# EAGLE design metaboard_mine (EAGLE 6.5.0)
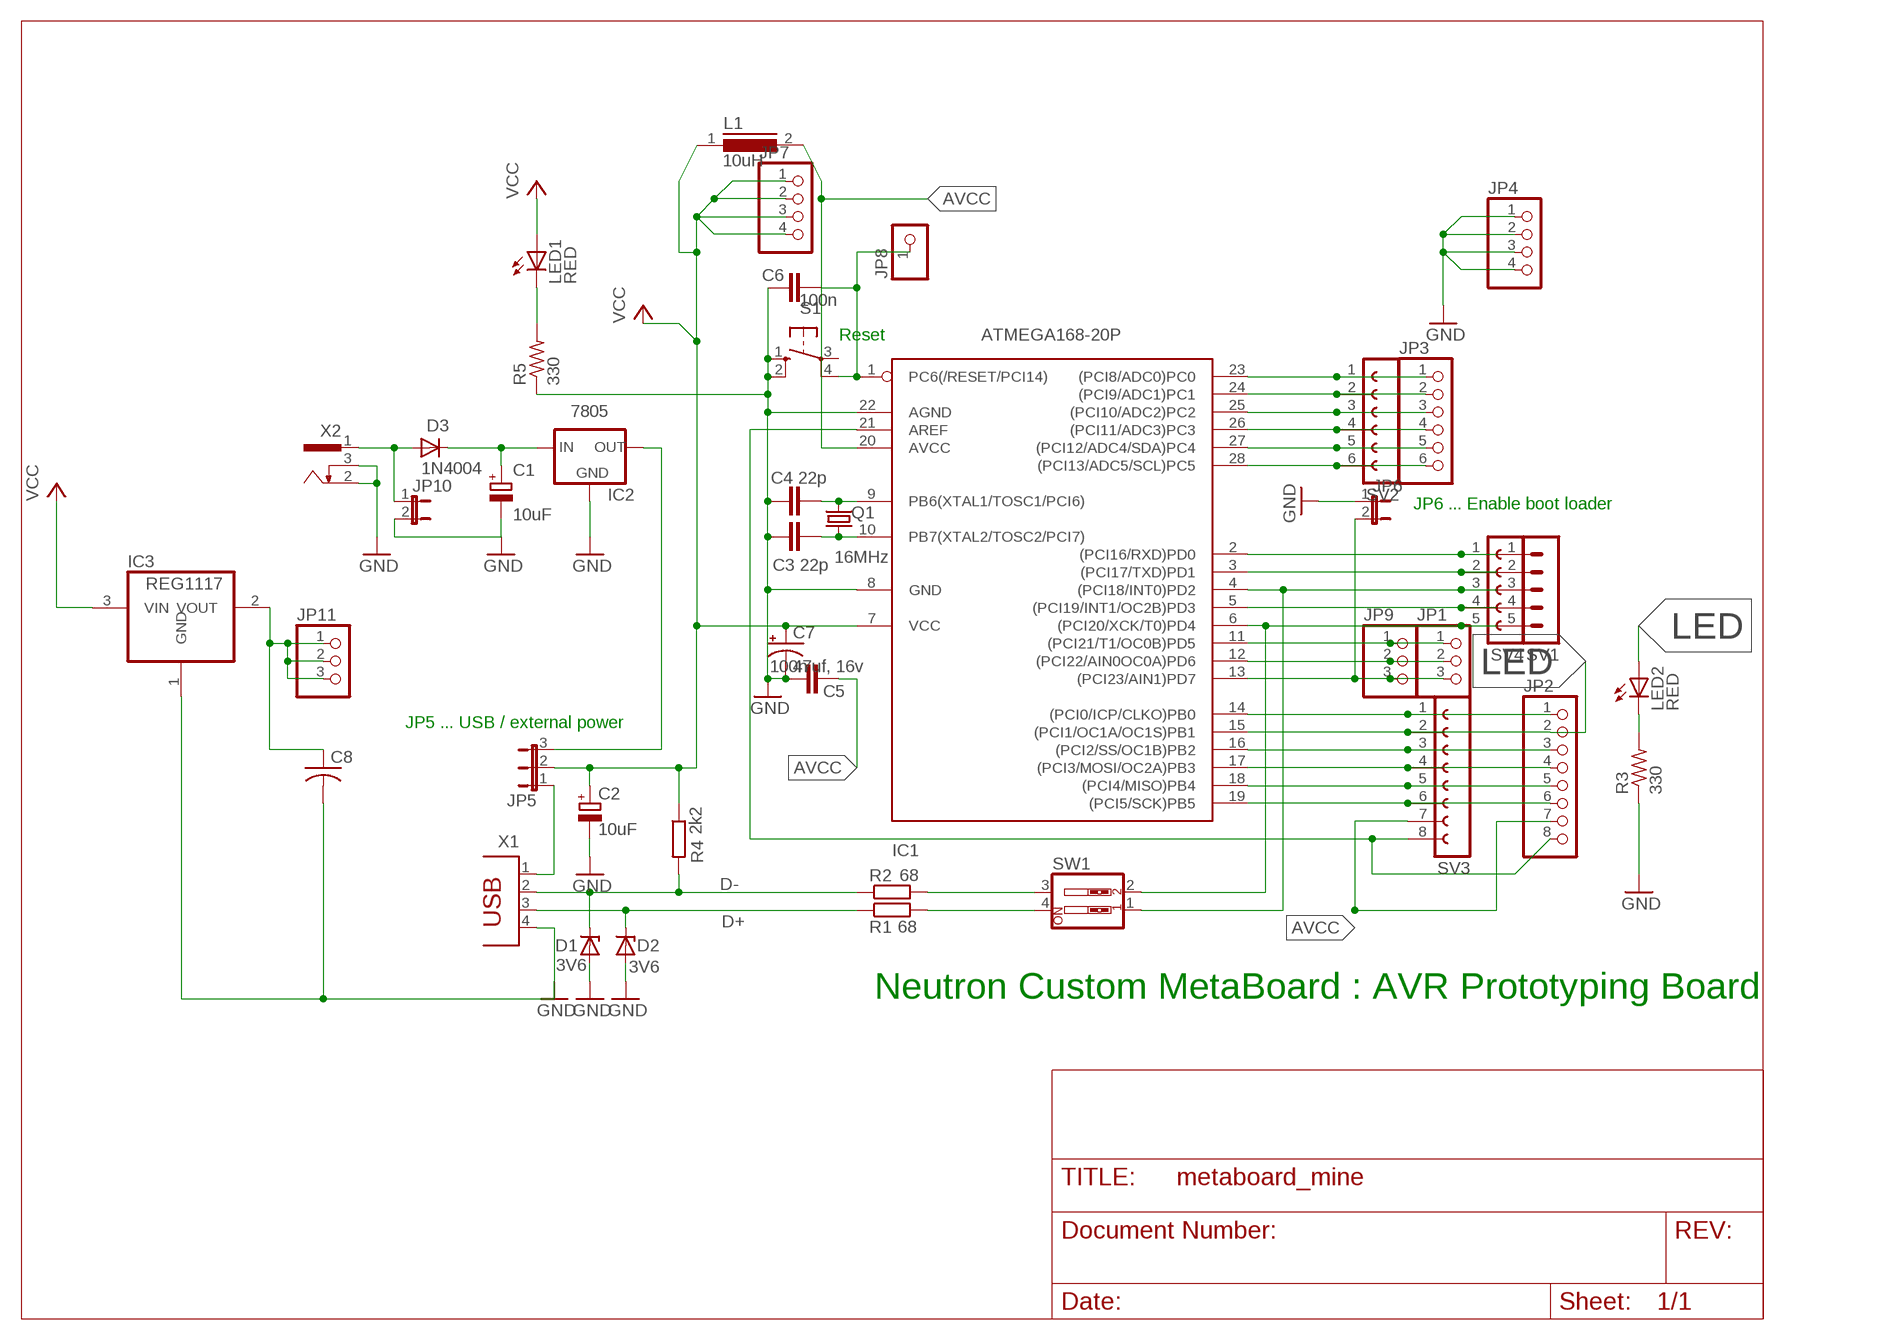
[diagram p0: schematic, sheet 1]

## Parts
C1  10uF  CPOL-EUE3.5-10  [E3,5-10]
C2  10uF  CPOL-EUE2,5-6E  [E2,5-6E]
C3  22p  C-EU025-024X044  [C025-024X044]
C4  22p  C-EU025-024X044  [C025-024X044]
C5  100n  C-EU050-025X075  [C050-025X075]
C6  100n  C-EU050-025X075  [C050-025X075]
C7  47uf, 16v  CPOL-USE2.5-6  [E2,5-6]
C8  C-USC0805K  [C0805K]
D1  3V6  ZENER-DIODEDO34-7  [DO34Z7]
D2  3V6  ZENER-DIODEDO34-7  [DO34Z7]
D3  1N4004  [DO41-10]
IC1  ATMEGA168-20P  [DIL28-3]
IC2  7805  78XXL  [78XXL]
IC3  REG1117  [SOT223]
JP1  PINHD-1X3  [1X03]
JP2  PINHD-1X8  [1X08]
JP3  PINHD-1X6  [1X06]
JP4  PINHD-1X4  [1X04]
JP5  JP2E  [JP2]
JP6  JP1E  [JP1]
JP7  PINHD-1X4  [1X04]
JP8  PINHD-1X1  [1X01]
JP9  PINHD-1X3  [1X03]
JP10  JP1E  [JP1]
JP11  PINHD-1X3  [1X03]
L1  10uH  MICC12  [MICC12]
LED1  RED  LED5MM  [LED5MM]
LED2  RED  LED3MM  [LED3MM]
Q1  16MHz  CRYSTALHC49S  [HC49/S]
R1  68  R-EU_0207/10  [0207/10]
R2  68  R-EU_0207/10  [0207/10]
R3  330  R-US_0207/10  [0207/10]
R4  2k2  R-EU_0207/10  [0207/10]
R5  330  R-US_0207/10  [0207/10]
S1  10-XX  [B3F-10XX]
SV1  MA05-1  [MA05-1]
SV2  FE06-1  [FE06]
SV3  FE08-1  [FE08]
SV4  FE05-1  [FE05-1]
SW1  SW_DIP-2  [EDG-02]
X1  PN61729  [PN61729]
X2  733980-62  [733980-62]

## Nets
+5USB: JP5.1 X1.1
+VRAW: C1.+ D3.C IC2.IN
AVCC: C5.1 IC1.20(AVCC) JP2.7 L1.2 SV3.7
D+ [thin]: D2.C R1.1 X1.3
D- [thin]: D1.C R2.1 R4.2 X1.2
GND: IC2.GND
LED: IC1.15((PCI1/OC1A/OC1S)PB1) JP2.2 LED2.A SV3.2
N$1 [thin]: IC1.6((PCI20/XCK/T0)PD4) SV1.5 SV4.5 SW1.2
N$2 [thin]: C6.2 IC1.1(PC6(/RESET/PCI14)) JP8.1 S1.4(P1)
N$3 [thin]: IC1.4((PCI18/INT0)PD2) SV1.3 SV4.3 SW1.1
N$4: D3.A JP10.1 X2.1
N$5 [thin]: R2.2 SW1.3
N$6: IC1.2((PCI16/RXD)PD0) SV1.1 SV4.1
N$7 [thin]: R1.2 SW1.4
N$8: IC2.OUT JP5.3
N$9: C3.2 IC1.10(PB7(XTAL2/TOSC2/PCI7)) Q1.1
N$10: C4.2 IC1.9(PB6(XTAL1/TOSC1/PCI6)) Q1.2
N$11: IC1.3((PCI17/TXD)PD1) SV1.2 SV4.2
N$12: IC1.5((PCI19/INT1/OC2B)PD3) SV1.4 SV4.4
N$13: IC1.11((PCI21/T1/OC0B)PD5) JP1.1 JP9.1
N$14: IC1.12((PCI22/AIN0OC0A)PD6) JP1.2 JP9.2
N$15 [thin]: IC1.13((PCI23/AIN1)PD7) JP1.3 JP6.2 JP9.3
N$16: IC1.23((PCI8/ADC0)PC0) JP3.1 SV2.1
N$17: IC1.24((PCI9/ADC1)PC1) JP3.2 SV2.2
N$18: IC1.25((PCI10/ADC2)PC2) JP3.3 SV2.3
N$19: IC1.26((PCI11/ADC3)PC3) JP3.4 SV2.4
N$20: IC1.27((PCI12/ADC4/SDA)PC4) JP3.5 SV2.5
N$21: IC1.28((PCI13/ADC5/SCL)PC5) JP3.6 SV2.6
N$22: LED2.K(C) R3.2
N$24: IC1.16((PCI2/SS/OC1B)PB2) JP2.3 SV3.3
N$25: IC1.17((PCI3/MOSI/OC2A)PB3) JP2.4 SV3.4
N$26: IC1.18((PCI4/MISO)PB4) JP2.5 SV3.5
N$27: IC1.19((PCI5/SCK)PB5) JP2.6 SV3.6
N$28: LED1.K(C) R5.2
N$29: IC1.21(AREF) JP2.8 SV3.8
N$33: IC1.14((PCI0/ICP/CLKO)PB0) JP2.1 SV3.1
N$36: C1.- C2.- C3.1 C4.1 C5.2 C6.1 C7.- C8.2 D1.A D2.A IC1.8(GND) IC1.22(AGND) IC3.1(GND) JP4.1 JP4.2 JP4.3 JP4.4 JP6.1 JP10.2 R3.1 R5.1 S1.1(S) S1.2(S1) X1.4 X2.2 X2.3 ; supply symbol labelled GND
N$37: C8.1 IC3.2(VOUT) JP11.1 JP11.2 JP11.3
VCC: C2.+ C7.+ IC1.7(VCC) IC3.3(VIN) JP5.2 JP7.1 JP7.2 JP7.3 JP7.4 L1.1 LED1.A R4.1
Unconnected: S1.3(P)

## Notes on the sheet
- Reset
- JP6 ... Enable boot loader
- JP5 ... USB / external power
- Neutron Custom MetaBoard : AVR Prototyping Board

## Library data of the parts
C1 C2 = rcl:CPOL-EU: POLARIZED CAPACITOR, European symbol
C3-C6 = rcl:C-EU: CAPACITOR, European symbol
C7 = adafruit:CPOL-US: POLARIZED CAPACITOR, American symbol
C8 = adafruit:C-US: CAPACITOR, American symbol
D1 D2 = diode:ZENER-DIODE: Z-Diode
D3 = diode:1N4004: DIODE general purpose rectifier, 1 A
IC1 = avr:ATMEGA168*P: MICROCONTROLLER 16 kBytes FLASH 1 kBytes SRAM 512 Bytes EEPROM USART 8-channel 10 bit ADC
IC2 = v-reg:78XXL: VOLTAGE REGULATOR
IC3 = burr-brown:REG1117: 800mA and 1A Low Dropout (LDO) Positive Regulator 1.8V, 2.5V, 2.85V, 3.3V, 5V, and Adj; MPN: REG1117; OC_FARNELL: 1097566; OC_NEWARK: 14P6981
JP1 JP11 = adafruit:PINHD-1X3: PIN HEADER
JP2 = pinhead:PINHD-1X8: PIN HEADER
JP3 = pinhead:PINHD-1X6: PIN HEADER
JP4 JP7 = pinhead:PINHD-1X4: PIN HEADER
JP5 = jumper:JP2E: JUMPER
JP6 JP10 = jumper:JP1E: JUMPER
JP8 = adafruit:PINHD-1X1: Pin header 1x1 for 0.1" spacing With round pins
JP9 = pinhead:PINHD-1X3: PIN HEADER
L1 = inductors:MICC12: INDUCTOR
LED1 LED2 = adafruit:LED: LED OSRAM: - CHIPLED LG R971, LG N971, LY N971, LG Q971, LY Q971, LO R971, LY R971 LH N974, LH R974 LS Q976, LO Q976, LY Q976 LO Q996 - Hyper CHIPLED LW Q18S LB Q993, LB Q99A, LB R99A - SideLED LS A670, LO A670, LY A670, LG A670, LP A670 LB A673, LV A673, LT A673, LW A673 LH A674 LY A675 LS A676, LA A676, LO A676, LY A676, LW A676 LS A679, LY A679, LG A679 - Hyper Micro SIDELED® LS Y876, LA Y876, LO Y876, LY Y876 LT Y87S - SmartLED LW L88C, LW L88S LB L89C, LB L89S, LG L890 LS L89K, LO L89K, LY L89K LS L896, LA L896, LO L896, LY L896 - TOPLED LS T670, LO T670, LY T670, LG T670, LP T670 LSG T670, LSP T670, LSY T670, LOP T670, LYG T670 LG T671, LOG T671, LSG T671 LB T673, LV T673, LT T673, LW T673 LH T674 LS T676, LA T676, LO T676, LY T676, LB T676, LH T676, LSB T676, LW T676 LB T67C, LV T67C, LT T67C, LS T67K, LO T67K, LY T67K, LW E67C LS E67B, LA E67B, LO E67B, LY E67B, LB E67C, LV E67C, LT E67C LW T67C LS T679, LY T679, LG T679 LS T770, LO T770, LY T770, LG T770, LP T770 LB T773, LV T773, LT T773, LW T773 LH T774 LS E675, LA E675, LY E675, LS T675 LS T776, LA T776, LO T776, LY T776, LB T776 LHGB T686 LT T68C, LB T68C - Hyper Mini TOPLED® LB M676 - Mini TOPLED Santana® LG M470 LS M47K, LO M47K, LY M47K Source: http://www.osram.convergy.de/
Q1 = crystal:CRYSTAL: CRYSTAL
R1 R2 R4 = rcl:R-EU_: RESISTOR, European symbol
R3 R5 = adafruit:R-US_: RESISTOR, American symbol
S1 = switch-omron:10-XX: OMRON SWITCH
SV1 = con-lstb:MA05-1: PIN HEADER; OC_FARNELL: unknown; OC_NEWARK: unknown
SV2 = con-lsta:FE06-1: FEMALE HEADER; OC_FARNELL: unknown; OC_NEWARK: unknown
SV3 = con-lsta:FE08-1: FEMALE HEADER; OC_FARNELL: unknown; OC_NEWARK: unknown
SV4 = con-lsta:FE05-1: FEMALE HEADER; OC_FARNELL: unknown; OC_NEWARK: unknown
SW1 = special:SW_DIP-2: DIP SWITCH
X1 = con-berg:PN61729: BERG USB connector
X2 = con-conrad:73398?: FEMALE PRINT CONNECTOR Niedervolt-Steckverbinder Distributor Conrad

## Net classes
0 default: width 0.508 mm, drill 1 mm, clearance 0.508 mm
1 thin: width 0.254 mm, drill 1 mm, clearance 0.254 mm

## Board
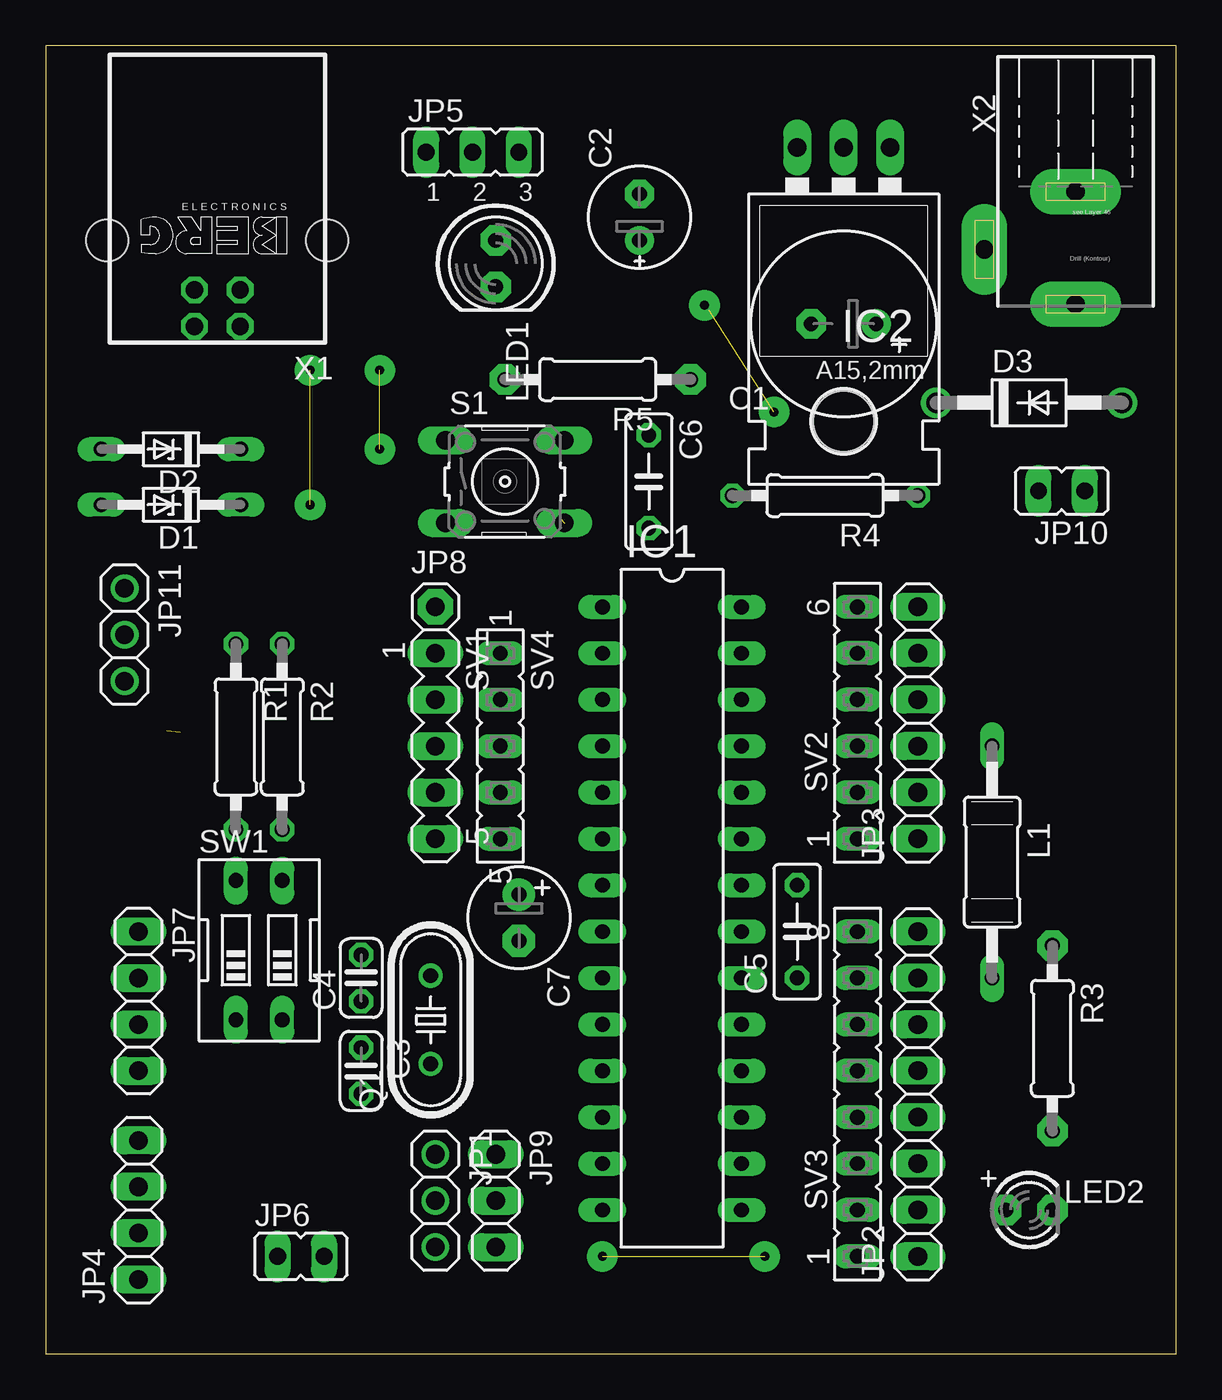
[diagram p1: board, top side]
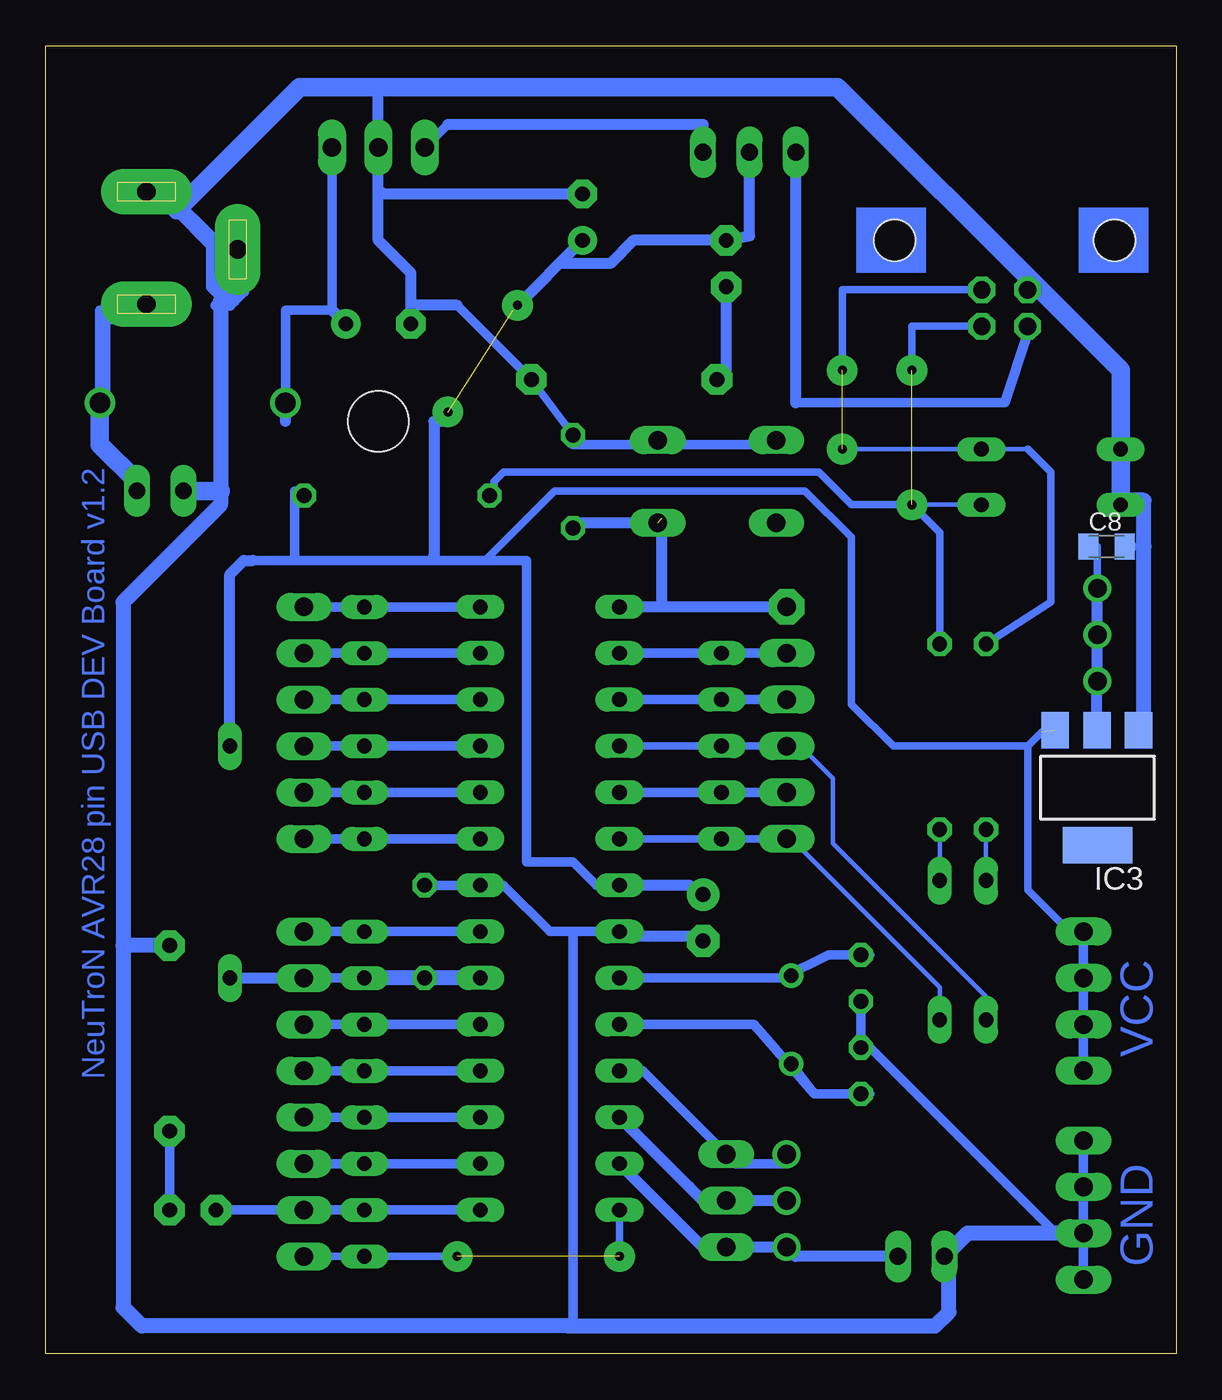
[diagram p2: board, bottom side, seen from below]

Size 61.9 x 71.62 mm. Coordinates in mm from the lower left corner, seen from the top.
Outline: 0,0 61.9,0 61.9,71.62 0,71.62 0,0
Copper layers (1*16): Top 0.035mm / dielectric 1.5mm / Bottom 0.035mm
Design rules "default": minimum track width 10mil, minimum drill 24mil, track to track 8mil, track to pad 8mil, pad to pad 8mil, via to via 8mil, smd to smd 8mil, copper to edge 40mil, drill to drill 8mil, minimum pad ring 10mil, minimum via ring 8mil, stop-mask expansion 4mil, vias tented up to drill 0mil, thermal gap 10mil

### Footprints (pad centres in the part's own frame; a part is rotated, then mirrored left to right if it is on the bottom)
E3,5-10 = drill 0.813 pad 1.6: + -1.778,0 | drill 0.813 pad 1.6 octagon: - 1.778,0
E2,5-6E = drill 0.813 pad 1.575: + -1.27,0 | drill 0.813 pad 1.575 octagon: - 1.27,0
C025-024X044 = drill 0.813 octagon: 1 -1.27,0; 2 1.27,0
C050-025X075 = drill 0.813 octagon: 1 -2.54,0; 2 2.54,0
E2,5-6 = drill 0.813 pad 1.778: + -1.27,0 | drill 0.813 pad 1.778 octagon: - 1.27,0
C0805K = smd 1.1 x 1.4: 1 -1,0; 2 1,0
DO34Z7 = drill 0.813 long: A 3.81,0; C -3.81,0
DO41-10 = drill 1.118: A 5.08,0; C -5.08,0
DIL28-3 = drill 0.813 long: 1 -16.51,-3.81; 2 -13.97,-3.81; 3 -11.43,-3.81; 4 -8.89,-3.81; 5 -6.35,-3.81; 6 -3.81,-3.81; 7 -1.27,-3.81; 8 1.27,-3.81; 9 3.81,-3.81; 10 6.35,-3.81; 11 8.89,-3.81; 12 11.43,-3.81; 13 13.97,-3.81; 14 16.51,-3.81; 15 16.51,3.81; 16 13.97,3.81; 17 11.43,3.81; 18 8.89,3.81; 19 6.35,3.81; 20 3.81,3.81; 21 1.27,3.81; 22 -1.27,3.81; 23 -3.81,3.81; 24 -6.35,3.81; 25 -8.89,3.81; 26 -11.43,3.81; 27 -13.97,3.81; 28 -16.51,3.81
78XXL = drill 1.016 long: GND 0,-3.81; IN -2.54,-3.81; OUT 2.54,-3.81 | hole 3.302: 0,11.176
SOT223 = smd 1.499 x 2.007: 1 -2.261,-3.15; 2 0.025,-3.15; 3 2.311,-3.15 | smd 3.81 x 2.007: 4 0,3.15
1X03 = drill 1.016: 1 -2.54,0; 2 0,0; 3 2.54,0
1X08 = drill 1.016 long: 1 -8.89,0; 2 -6.35,0; 3 -3.81,0; 4 -1.27,0; 5 1.27,0; 6 3.81,0; 7 6.35,0; 8 8.89,0
1X06 = drill 1.016 long: 1 -6.35,0; 2 -3.81,0; 3 -1.27,0; 4 1.27,0; 5 3.81,0; 6 6.35,0
1X04 = drill 1.016 long: 1 -3.81,0; 2 -1.27,0; 3 1.27,0; 4 3.81,0
JP2 = drill 0.914 long: 1 -2.54,0; 2 0,0; 3 2.54,0
JP1 = drill 0.914 long: 1 0,-1.27; 2 0,1.27
1X01 = drill 1.016 pad 1.93 octagon: 1 0,0
1X03' = drill 1.016 long: 1 -2.54,0; 2 0,0; 3 2.54,0
MICC12 = drill 0.813 long: 1 -6.35,0; 2 6.35,0
LED5MM = drill 0.813 pad 1.676 octagon: A -1.27,0; K 1.27,0
LED3MM = drill 0.813 pad 1.676 octagon: A -1.27,0; K 1.27,0
HC49/S = drill 0.813: 1 -2.413,0; 2 2.413,0
0207/10 = drill 0.813 octagon: 1 -5.08,0; 2 5.08,0
0207/10' = drill 0.813 pad 1.676 octagon: 1 -5.08,0; 2 5.08,0
B3F-10XX = drill 1.016 long: 1 -3.251,2.261; 2 3.251,2.261; 3 -3.251,-2.261; 4 3.251,-2.261
MA05-1 = drill 1.016 long: 1 -5.08,0; 2 -2.54,0; 3 0,0; 4 2.54,0; 5 5.08,0
FE06 = drill 0.813 long: 1 -6.35,0; 2 -3.81,0; 3 -1.27,0; 4 1.27,0; 5 3.81,0; 6 6.35,0
FE08 = drill 0.813 long: 1 -8.89,0; 2 -6.35,0; 3 -3.81,0; 4 -1.27,0; 5 1.27,0; 6 3.81,0; 7 6.35,0; 8 8.89,0
FE05-1 = drill 0.813 long: 1 -5.08,0; 2 -2.54,0; 3 0,0; 4 2.54,0; 5 5.08,0
EDG-02 = drill 0.813 long: 1 -1.27,-3.81; 2 1.27,-3.81; 3 1.27,3.81; 4 -1.27,3.81
PN61729 = drill 0.95 octagon: 1 1.25,4.71; 2 -1.25,4.71; 3 -1.25,2.71; 4 1.25,2.71 | hole 2.3: -6.02,0; 6.02,0
733980-62 = drill 1 pad 2.5 long: 1 0,8.57; 2 0,2.42; 3 5,5.57

### Placement (x,y rotation side)
C1  43.69,56.39 180 top
C2  32.51,62.23 90 top
C3  17.27,15.49 270 top
C4  17.27,20.57 90 top
C5  41.15,23.11 90 top
C6  33.02,47.75 270 top
C7  25.91,23.88 270 top
C8  3.81,44.2 0 bottom
D1  6.86,46.48 180 top
D2  6.86,49.53 180 top
D3  53.85,52.07 0 top
IC1  34.29,24.38 270 top
IC2  43.69,62.23 180 top
IC3  4.32,30.99 180 bottom
JP1  21.34,8.38 270 top
JP2  47.75,14.22 90 top
JP3  47.75,34.54 90 top
JP4  5.08,7.87 90 top
JP5  23.37,65.79 0 top
JP6  13.97,5.33 270 top
JP7  5.08,19.3 270 top
JP8  21.34,40.89 0 top
JP9  [1X03']  24.64,8.38 270 top
JP10  55.63,47.24 90 top
JP11  4.32,39.37 270 top
L1  51.82,26.92 270 top
LED1  24.64,59.69 270 top
LED2  53.85,7.87 0 top
Q1  21.08,18.29 90 top
R1  10.41,33.78 270 top
R2  12.95,33.78 270 top
R3  330  [0207/10']  55.12,17.27 270 top
R4  42.67,46.99 180 top
R5  330  [0207/10']  30.23,53.34 180 top
S1  25.15,47.75 0 top
SV1  21.34,33.27 270 top
SV2  44.45,34.54 90 top
SV3  44.45,14.22 90 top
SV4  24.89,33.27 270 top
SW1  11.68,22.1 0 top
X1  9.4,60.96 180 top
X2  56.39,66.04 180 top

### Tracks (layer width: path | path; a pad name or v marks a point on that pad's centre or on a via)
+5USB
  Bottom 0.508: 20.83,52.07 9.4,52.07 8.13,55.88 X1.1
  Bottom 0.61: 20.83,52.07 JP5.1
+VRAW
  Bottom 0.508: IC2.IN 46.23,57.15 48.77,57.15 D3.C
  Bottom 0.61: 48.77,51.05 D3.C | C1.+ 46.23,57.15
AVCC
  Bottom 0.508: JP2.7 SV3.7
  Bottom 0.61: L1.2 JP2.7
  Bottom 0.813: IC1.20 C5.1 SV3.7 | JP2.7 48.01,20.32
D+  (via drill 0.5 pad 1.68)  (1 unrouted)
  Bottom 0.254: 8.13,49.53 D2.C v18.29,49.53
  Bottom 0.406: 8.13,49.53 6.86,48.26 6.86,41.15 R1.1 | X1.3 18.29,58.25 18.29,53.85
D-  (via drill 0.5 pad 1.68)  (1 unrouted)
  Bottom 0.254: D1.C v14.48,46.48 | 12.7,38.35 R2.1
  Bottom 0.406: R4.2 37.34,46.99 37.34,47.75 36.83,48.26 19.56,48.26 17.78,46.48 v14.48,46.48 12.95,44.96 R2.1 | X1.2 14.48,56.25 14.48,53.85
LED
  Bottom 0.508: IC1.15 SV3.2 JP2.2 LED2.A
N$1
  Bottom 0.254: SW1.2 12.95,20.07 21.08,28.19 SV1.5
  Bottom 0.406: IC1.6 SV4.5 SV1.5
N$2  (1 unrouted)
  Bottom 0.254: 33.02,44.7 C6.2
  Bottom 0.61: S1.4 32.74,45.49 C6.2 | JP8.1 28.19,40.89 | 28.19,40.89 IC1.1 | 28.19,45.72 28.19,40.89
N$3
  Bottom 0.254: 25.4,33.27 SV4.3 | SW1.1 10.41,19.56 18.8,27.94 18.8,31.5 20.83,33.53 21.08,33.53 SV1.3
  Bottom 0.406: IC1.4 SV4.3 SV1.3
N$4
  Bottom 0.508: D3.A 58.93,57.15 56.39,57.15 X2.1
  Bottom 0.61: 56.39,57.15 58.42,57.15 58.42,56.9 56.39,56.9
  Bottom 1.016: JP10.1 56.9,47.75 58.93,49.78 D3.A
N$5
  Bottom 0.254: R2.2 SW1.3
N$6
  Bottom 0.508: SV1.1 SV4.1 25.4,38.35 IC1.2
N$7
  Bottom 0.254: R1.2 SW1.4
N$8
  Bottom 0.508: IC2.OUT 39.88,67.31
  Bottom 0.61: 39.88,67.31 25.91,67.31 JP5.3
N$9
  Bottom 0.508: 19.81,14.22 C3.2 16.76,14.22 | IC1.10 23.11,18.03 19.81,14.22 | 19.81,14.22 Q1.1
N$10
  Bottom 0.508: 21.59,20.57 IC1.9 | 21.59,20.57 19.05,21.84 C4.2 16.76,21.84 | 21.59,20.57 Q1.2
N$11
  Bottom 0.508: SV1.2 SV4.2 25.4,35.81 IC1.3
N$12
  Bottom 0.508: SV1.4 SV4.4 25.4,30.73 IC1.5
N$13
  Bottom 0.508: IC1.11 29.21,15.49 JP9.1 24.13,10.41 21.59,10.41 JP1.1
N$14
  Bottom 0.508: 26.67,9.14 25.4,7.87 JP9.2
  Bottom 0.61: JP1.2 JP9.2 25.91,8.38 26.67,9.14 IC1.12
N$15
  Bottom 0.61: JP6.2 20.83,5.33 JP1.3 JP9.3 25.91,5.84 IC1.13
N$16
  Bottom 0.508: JP3.1 SV2.1 IC1.23
N$17
  Bottom 0.508: JP3.2 SV2.2 IC1.24
N$18
  Bottom 0.508: JP3.3 SV2.3 IC1.25
N$19
  Bottom 0.508: JP3.4 SV2.4 IC1.26
N$20
  Bottom 0.508: JP3.5 SV2.5 IC1.27
N$21
  Bottom 0.508: JP3.6 SV2.6 IC1.28
N$22
  Bottom 0.508: R3.2 LED2.K
N$23  (via drill 1.4)
  other vias: 15.49,60.96
N$24
  Bottom 0.508: JP2.3 SV3.3 IC1.16
N$25
  Bottom 0.508: JP2.4 SV3.4 IC1.17
N$26
  Bottom 0.508: JP2.5 SV3.5 IC1.18
N$27
  Bottom 0.508: JP2.6 SV3.6 IC1.19
N$28
  Bottom 0.61: R5.2 24.64,53.85 LED1.K
N$29
  Bottom 0.508: IC1.21 SV3.8 JP2.8
N$30  (via drill 0.5 pad 1.68)
  other vias: 14.48,53.85
N$31  (via drill 0.5 pad 1.68)
  other vias: 18.29,53.85
N$33  (via drill 0.5 pad 1.68)  (1 unrouted)
  Bottom 0.406: IC1.14 v30.48,5.33 | v39.37,5.33 SV3.1 JP2.1
N$35
  Bottom 0.61: 56.39,56.64 58.67,56.64 58.67,52.07
N$36
  Bottom 0.406: R5.1 C6.1 | C8.2 1.78,44.2
  Bottom 0.508: X2.2 56.39,63.5 55.12,63.5 52.58,60.96 X2.3 52.58,59.69 | 33.02,23.11 34.29,23.11 36.83,25.65 IC1.22 C5.2 | 33.02,23.11 IC1.8 | C4.1 C3.1 16.76,16.76 6.6,6.6 JP4.2 | JP4.4 JP4.3 JP4.2 | JP4.2 JP4.1 | 33.27,1.52 33.02,1.52 33.02,23.11 | 8.13,58.42 X1.4 | 39.37,57.4 R5.1 | S1.1 22.86,49.78 27.94,49.78 S1.2 29.21,49.78 33.02,49.78 C6.1
  Bottom 0.61: 51.31,60.71 51.82,60.71 | 51.82,60.71 52.07,60.71 | 52.32,60.71 52.83,60.71 | 52.83,60.71 54.74,62.61 55.37,63.25 56.64,63.25 | 52.83,60.71 52.83,58.42 52.32,57.91 52.32,60.45 52.07,60.71 | 52.07,60.71 52.32,60.71 | 52.32,60.71 52.32,57.66 | 51.56,60.45 51.56,57.66 52.32,57.66 | 52.32,57.66 52.32,57.15 52.07,57.4 52.07,60.45 51.82,60.71 | 51.82,60.71 51.82,58.17 52.32,57.66 | 52.32,57.66 52.58,57.4 51.82,57.4 51.05,58.17 51.05,60.96 51.56,61.47 52.07,61.47 52.58,60.96 | C7.- 26.42,22.61 26.67,22.86 30.23,22.86 IC1.8 | 39.37,57.4 41.91,57.4 | 41.91,57.4 41.91,59.18 43.69,60.96 43.69,63.75 | 41.91,57.4 C1.- | IC3.1 2.29,34.14 | 2.29,46.48 D1.A 3.3,46.48 | 43.69,63.75 43.69,69.34 | X1.4 7.45,58.25 6.99,57.78 | 43.69,63.75 43.43,63.5 C2.-
  Bottom 0.813: 57.66,22.35 57.66,2.54 56.64,1.52 33.27,1.52 13.21,1.52 12.45,2.29 12.45,5.08 JP6.1 11.43,6.6 JP4.2 | R3.1 57.66,22.35 | 52.32,57.66 52.32,47.24 52.32,46.48 57.66,41.15 57.66,22.35 | 2.29,34.14 1.78,34.14 1.78,44.2 1.78,46.74 3.05,46.74 D1.A
  Bottom 1.016: D1.A D2.A 3.05,53.85 6.99,57.78 18.54,69.34 43.69,69.34 48.01,69.34 54.74,62.61 | JP10.2 52.32,47.24
N$37
  Bottom 0.406: C8.1 4.32,44.2 JP11.1
  Bottom 0.61: IC3.2 4.34,36.8 JP11.3 JP11.2 JP11.1
N$38  (via drill 0.5 pad 1.68)
  other vias: 39.88,51.56
N$39  (via drill 0.5 pad 1.68)
  other vias: 36.07,57.4
N$41  (via drill 1.4)
  other vias: 3.3,60.96
VCC  (2 unrouted)
  Bottom 0.406: 5.59,16 JP7.4 | 37.85,43.43 34.04,47.24 20.32,47.24 17.78,44.7 17.78,35.56 15.49,33.27 8.13,33.27 | JP7.1 5.84,23.11 8.13,25.4 8.13,33.27 | 7.37,34.04 8.13,33.27
  Bottom 0.508: JP7.4 JP7.3 JP7.2 JP7.1 | IC1.7 31.75,25.65 33.02,26.92 35.56,26.92 35.56,43.43 37.85,43.43 40.64,43.43 | 40.64,43.43 48.26,43.43 | 48.26,43.43 50.55,43.43 | 48.26,43.43 48.26,47.24 R4.1 | 40.64,43.43 40.64,43.69
  Bottom 0.61: 40.64,43.69 40.64,51.05 39.88,51.05 39.88,51.56 40.13,51.56 40.13,51.31 | C7.+ 26.16,25.15 26.67,25.65 IC1.7 | L1.1 51.82,42.67 51.05,43.43 50.55,43.43 | JP5.2 23.37,61.21 LED1.A 29.72,60.96 30.99,59.69 33.78,59.69 C2.+ 36.32,57.15
(copper drawn outside any net)
  shapes: Bottom area x2

### Text on the board
Bottom: NeuTroN AVR28 pin USB DEV Board v1.2 | VCC | GND